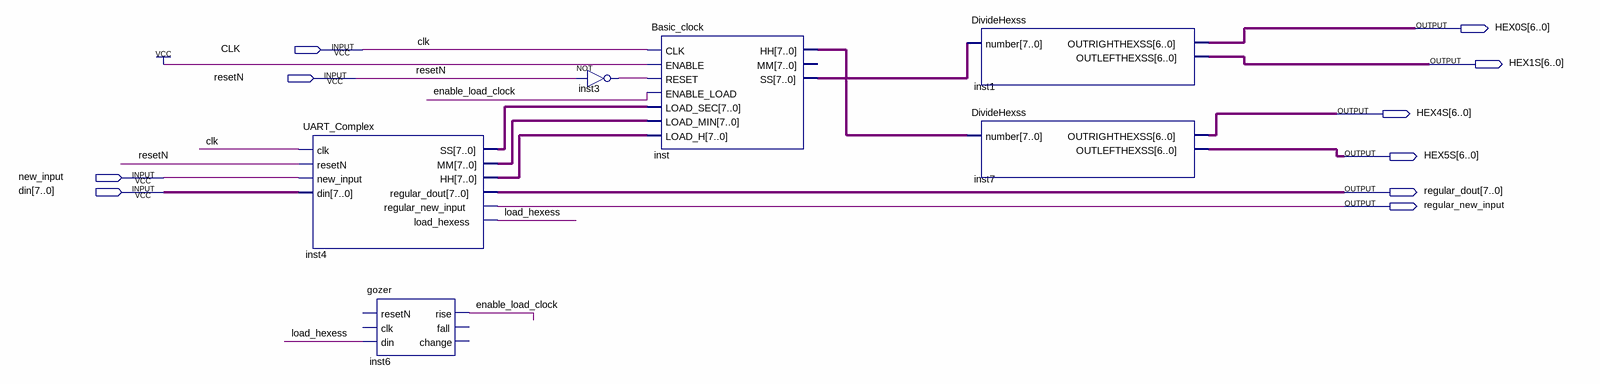
[diagram p0: schematic sheet]
// Quartus schematic peace.bdf as structural Verilog: 6 symbols, 10 pins
module peace (
  input  CLK,
  input  resetN,
  input  new_input,
  input  [7:0] din,
  output [6:0] HEX0S,
  output [6:0] HEX1S,
  output [6:0] HEX4S,
  output [6:0] HEX5S,
  output [7:0] regular_dout,
  output regular_new_input
);

  wire enable_load_clock, inst3_out, load_hexess;
  wire [7:0] inst4_hh, inst4_mm, inst4_ss, inst_hh, inst_ss;

  UART_Complex inst4 (
    .clk(CLK), .resetN(resetN), .new_input(new_input), .din(din), .SS(inst4_ss), .MM(inst4_mm),
    .HH(inst4_hh), .regular_dout(regular_dout), .regular_new_input(regular_new_input),
    .load_hexess(load_hexess));
  gozer inst6 (.din(load_hexess), .rise(enable_load_clock));  // open: resetN, clk, fall, change
  not inst3 (inst3_out, resetN);
  Basic_clock inst (
    .CLK(CLK), .ENABLE(1'b1), .RESET(inst3_out), .ENABLE_LOAD(enable_load_clock), .LOAD_SEC(inst4_ss),
    .LOAD_MIN(inst4_mm), .LOAD_H(inst4_hh), .HH(inst_hh), .SS(inst_ss));  // open: MM
  DivideHexss inst1 (.number(inst_ss), .OUTRIGHTHEXSS(HEX0S), .OUTLEFTHEXSS(HEX1S));
  DivideHexss inst7 (.number(inst_hh), .OUTRIGHTHEXSS(HEX4S), .OUTLEFTHEXSS(HEX5S));
endmodule
